# EAGLE design shield_confortimetro_bia_v2 (EAGLE 7.7.0)
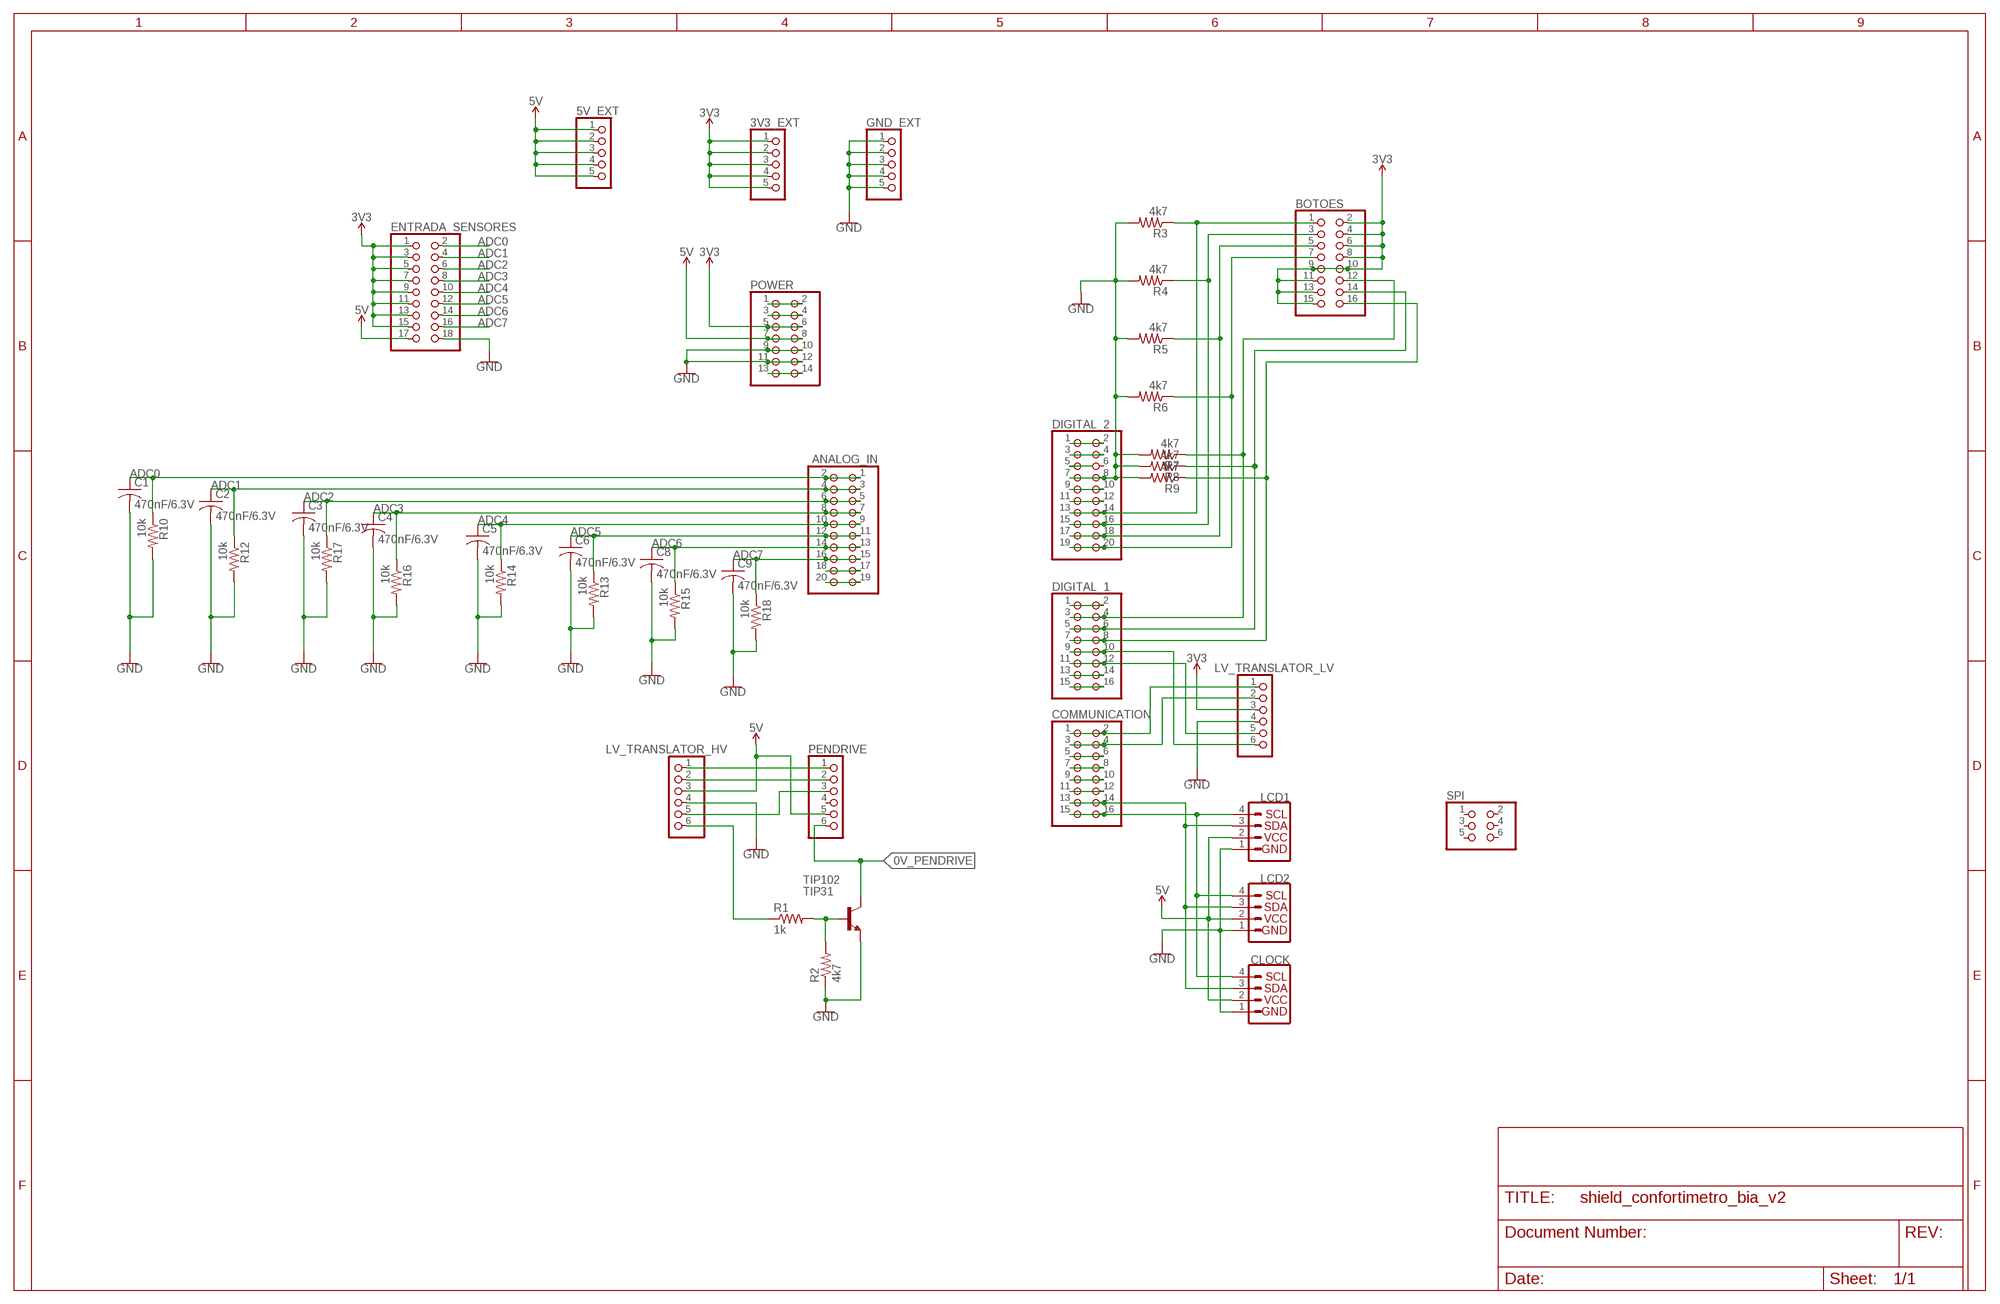
[diagram p0: schematic, sheet 1]

## Parts
3V3_EXT  PINHD-1X5  [1X05]
5V_EXT  PINHD-1X5  [1X05]
ANALOG_IN  PINHD-2X10  [2X10]
BOTOES  PINHD-2X8  [2X08]
C1  470nF/6.3V  C-US050-030X075  [C050-030X075]
C2  470nF/6.3V  C-US050-030X075  [C050-030X075]
C3  470nF/6.3V  C-US050-030X075  [C050-030X075]
C4  470nF/6.3V  C-US050-030X075  [C050-030X075]
C5  470nF/6.3V  C-US050-030X075  [C050-030X075]
C6  470nF/6.3V  C-US050-030X075  [C050-030X075]
C8  470nF/6.3V  C-US050-030X075  [C050-030X075]
C9  470nF/6.3V  C-US050-030X075  [C050-030X075]
CLOCK  I2C_STANDARD  [1X04]
COMMUNICATION  PINHD-2X8  [2X08]
DIGITAL_1  PINHD-2X8  [2X08]
DIGITAL_2  PINHD-2X10  [2X10]
ENTRADA_SENSORES  PINHD-2X9  [2X09]
GND_EXT  PINHD-1X5  [1X05]
LCD1  I2C_STANDARD  [1X04]
LCD2  I2C_STANDARD  [1X04]
LV_TRANSLATOR_HV  PINHD-1X6  [1X06]
LV_TRANSLATOR_LV  PINHD-1X6  [1X06]
PENDRIVE  PINHD-1X6  [1X06]
POWER  PINHD-2X7  [2X07]
R1  1k  R-US_0309/12  [0309/12]
R2  4k7  R-US_0309/12  [0309/12]
R3  4k7  R-US_0309/12  [0309/12]
R4  4k7  R-US_0309/12  [0309/12]
R5  4k7  R-US_0309/12  [0309/12]
R6  4k7  R-US_0309/12  [0309/12]
R7  4k7  R-US_0309/12  [0309/12]
R8  4k7  R-US_0309/12  [0309/12]
R9  4k7  R-US_0309/12  [0309/12]
R10  10k  R-US_0309/12  [0309/12]
R12  10k  R-US_0309/12  [0309/12]
R13  10k  R-US_0309/12  [0309/12]
R14  10k  R-US_0309/12  [0309/12]
R15  10k  R-US_0309/12  [0309/12]
R16  10k  R-US_0309/12  [0309/12]
R17  10k  R-US_0309/12  [0309/12]
R18  10k  R-US_0309/12  [0309/12]
SPI  PINHD-2X3  [2X03]
TIP102  TIP31  [TO220]

## Nets
0V_PENDRIVE: PENDRIVE.6 TIP102.2(C)
ADC0: ANALOG_IN.1 ANALOG_IN.2 C1.1 ENTRADA_SENSORES.2 R10.1
ADC1: ANALOG_IN.3 ANALOG_IN.4 C2.1 ENTRADA_SENSORES.4 R12.1
ADC2: ANALOG_IN.5 ANALOG_IN.6 C3.1 ENTRADA_SENSORES.6 R17.1
ADC3: ANALOG_IN.7 ANALOG_IN.8 C4.1 ENTRADA_SENSORES.8 R16.1
ADC4: ANALOG_IN.9 ANALOG_IN.10 C5.1 ENTRADA_SENSORES.10 R14.1
ADC5: ANALOG_IN.11 ANALOG_IN.12 C6.1 ENTRADA_SENSORES.12 R13.1
ADC6: ANALOG_IN.13 ANALOG_IN.14 C8.1 ENTRADA_SENSORES.14 R15.1
ADC7: ANALOG_IN.15 ANALOG_IN.16 C9.1 ENTRADA_SENSORES.16 R18.1
GND: C1.2 C2.2 C3.2 C4.2 C5.2 C6.2 C8.2 C9.2 CLOCK.1 DIGITAL_2.7 DIGITAL_2.8 ENTRADA_SENSORES.18 GND_EXT.1 GND_EXT.2 GND_EXT.3 GND_EXT.4 GND_EXT.5 LCD1.1 LCD2.1 LV_TRANSLATOR_HV.4 LV_TRANSLATOR_LV.4 POWER.9 POWER.10 POWER.11 POWER.12 R2.1 R3.2 R4.2 R5.2 R6.2 R7.2 R8.2 R9.2 R10.2 R12.2 R13.2 R14.2 R15.2 R16.2 R17.2 R18.2 TIP102.3(E)
N$1: CLOCK.3 COMMUNICATION.13 COMMUNICATION.14 LCD1.3 LCD2.3
N$2: CLOCK.4 COMMUNICATION.15 COMMUNICATION.16 LCD1.4 LCD2.4
N$3: COMMUNICATION.1 COMMUNICATION.2 LV_TRANSLATOR_LV.1
N$4: COMMUNICATION.3 COMMUNICATION.4 LV_TRANSLATOR_LV.2
N$5: DIGITAL_1.9 DIGITAL_1.10 LV_TRANSLATOR_LV.6
N$6: DIGITAL_1.11 DIGITAL_1.12 LV_TRANSLATOR_LV.5
N$7: LV_TRANSLATOR_HV.1 PENDRIVE.1
N$8: LV_TRANSLATOR_HV.2 PENDRIVE.2
N$9: LV_TRANSLATOR_HV.5 PENDRIVE.3
N$10: R1.2 R2.2 TIP102.1(B)
N$11: LV_TRANSLATOR_HV.6 R1.1
N$12: BOTOES.12 DIGITAL_1.3 DIGITAL_1.4 R7.1
N$13: BOTOES.14 DIGITAL_1.5 DIGITAL_1.6 R8.1
N$14: BOTOES.16 DIGITAL_1.7 DIGITAL_1.8 R9.1
N$15: BOTOES.7 DIGITAL_2.19 DIGITAL_2.20 R6.1
N$16: BOTOES.5 DIGITAL_2.17 DIGITAL_2.18 R5.1
N$17: BOTOES.3 DIGITAL_2.15 DIGITAL_2.16 R4.1
N$18: BOTOES.1 DIGITAL_2.13 DIGITAL_2.14 R3.1
N$19: POWER.1 POWER.2
N$20: POWER.3 POWER.4
N$21: POWER.13 POWER.14
N$25: DIGITAL_2.1 DIGITAL_2.2
N$26: DIGITAL_2.3 DIGITAL_2.4
N$27: DIGITAL_2.5
N$29: DIGITAL_2.9 DIGITAL_2.10
N$30: DIGITAL_2.11 DIGITAL_2.12
N$31: DIGITAL_1.1 DIGITAL_1.2
N$32: DIGITAL_1.13 DIGITAL_1.14
N$33: DIGITAL_1.15 DIGITAL_1.16
N$34: COMMUNICATION.5 COMMUNICATION.6
N$35: COMMUNICATION.7 COMMUNICATION.8
N$36: COMMUNICATION.9 COMMUNICATION.10
N$37: COMMUNICATION.11 COMMUNICATION.12
N$38: ANALOG_IN.17 ANALOG_IN.18
N$39: ANALOG_IN.19 ANALOG_IN.20
VCC_3V3: 3V3_EXT.1 3V3_EXT.2 3V3_EXT.3 3V3_EXT.4 3V3_EXT.5 BOTOES.2 BOTOES.4 BOTOES.6 BOTOES.8 BOTOES.9 BOTOES.10 BOTOES.11 BOTOES.13 BOTOES.15 ENTRADA_SENSORES.1 ENTRADA_SENSORES.3 ENTRADA_SENSORES.5 ENTRADA_SENSORES.7 ENTRADA_SENSORES.9 ENTRADA_SENSORES.11 ENTRADA_SENSORES.13 ENTRADA_SENSORES.15 LV_TRANSLATOR_LV.3 POWER.5 POWER.6 ; supply symbol labelled 3V3
VCC_5V: 5V_EXT.1 5V_EXT.2 5V_EXT.3 5V_EXT.4 5V_EXT.5 CLOCK.2 ENTRADA_SENSORES.17 LCD1.2 LCD2.2 LV_TRANSLATOR_HV.3 PENDRIVE.5 POWER.7 POWER.8 ; supply symbol labelled 5V
Unconnected: DIGITAL_2.6 PENDRIVE.4 SPI.1 SPI.2 SPI.3 SPI.4 SPI.5 SPI.6

## Library data of the parts
3V3_EXT 5V_EXT GND_EXT = pinhead:PINHD-1X5: PIN HEADER
ANALOG_IN = SparkFun-Retired:PINHD-2X10: PIN HEADER
BOTOES COMMUNICATION DIGITAL_1 = pinhead:PINHD-2X8: PIN HEADER
C1-C6 C8 C9 = adafruit:C-US: CAPACITOR, American symbol
CLOCK LCD1 LCD2 = SparkFun-Connectors:I2C_STANDARD: SparkFun I2C Standard Pinout Header SparkFun has standardized on a pinout for all I2C based sensor breakouts. This pinout allows I2C boards to be plugged directly into the headers on Arduino Uno compatible boards, and to be daisy chained easily. Example SparkFun Products: SparkFun Atmospheric Sensor Breakout - BME280 <https://www.sparkfun.com/products/13676> SparkFun Altitude/Pressure Sensor Breakout - MPL3115A2 <https://www.sparkfun.com/products/11084> SparkFun TOF Range Finder Sensor - VL6180 <https://www.sparkfun.com/products/12785>
DIGITAL_2 = pinhead:PINHD-2X10: PIN HEADER
ENTRADA_SENSORES = pinhead:PINHD-2X9: PIN HEADER
LV_TRANSLATOR_HV LV_TRANSLATOR_LV PENDRIVE = adafruit:PINHD-1X6: PIN HEADER
POWER = pinhead:PINHD-2X7: PIN HEADER
R1-R10 R12-R18 = adafruit:R-US_: RESISTOR, American symbol
SPI = pinhead:PINHD-2X3: PIN HEADER
TIP102 = transistor:TIP31: NPN Transistor Medium Power Linear Switching Applications Source: http://onsemi.com

## Board
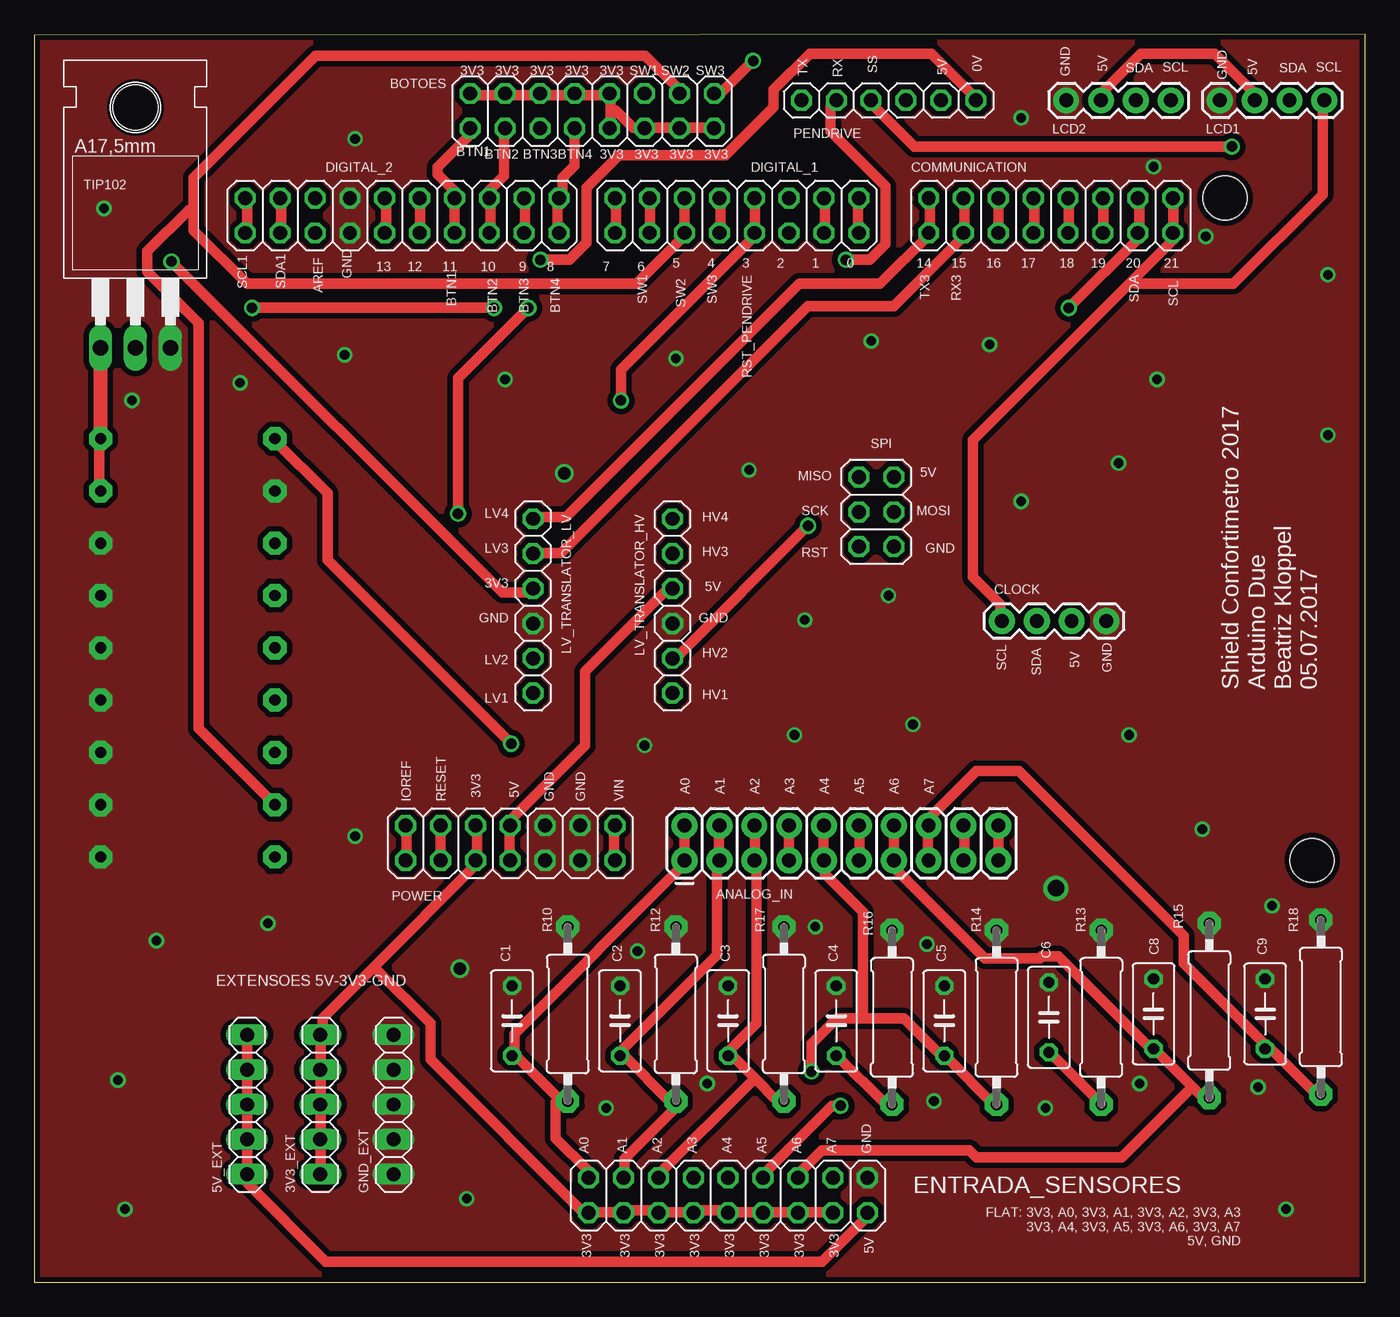
[diagram p1: board, top side]
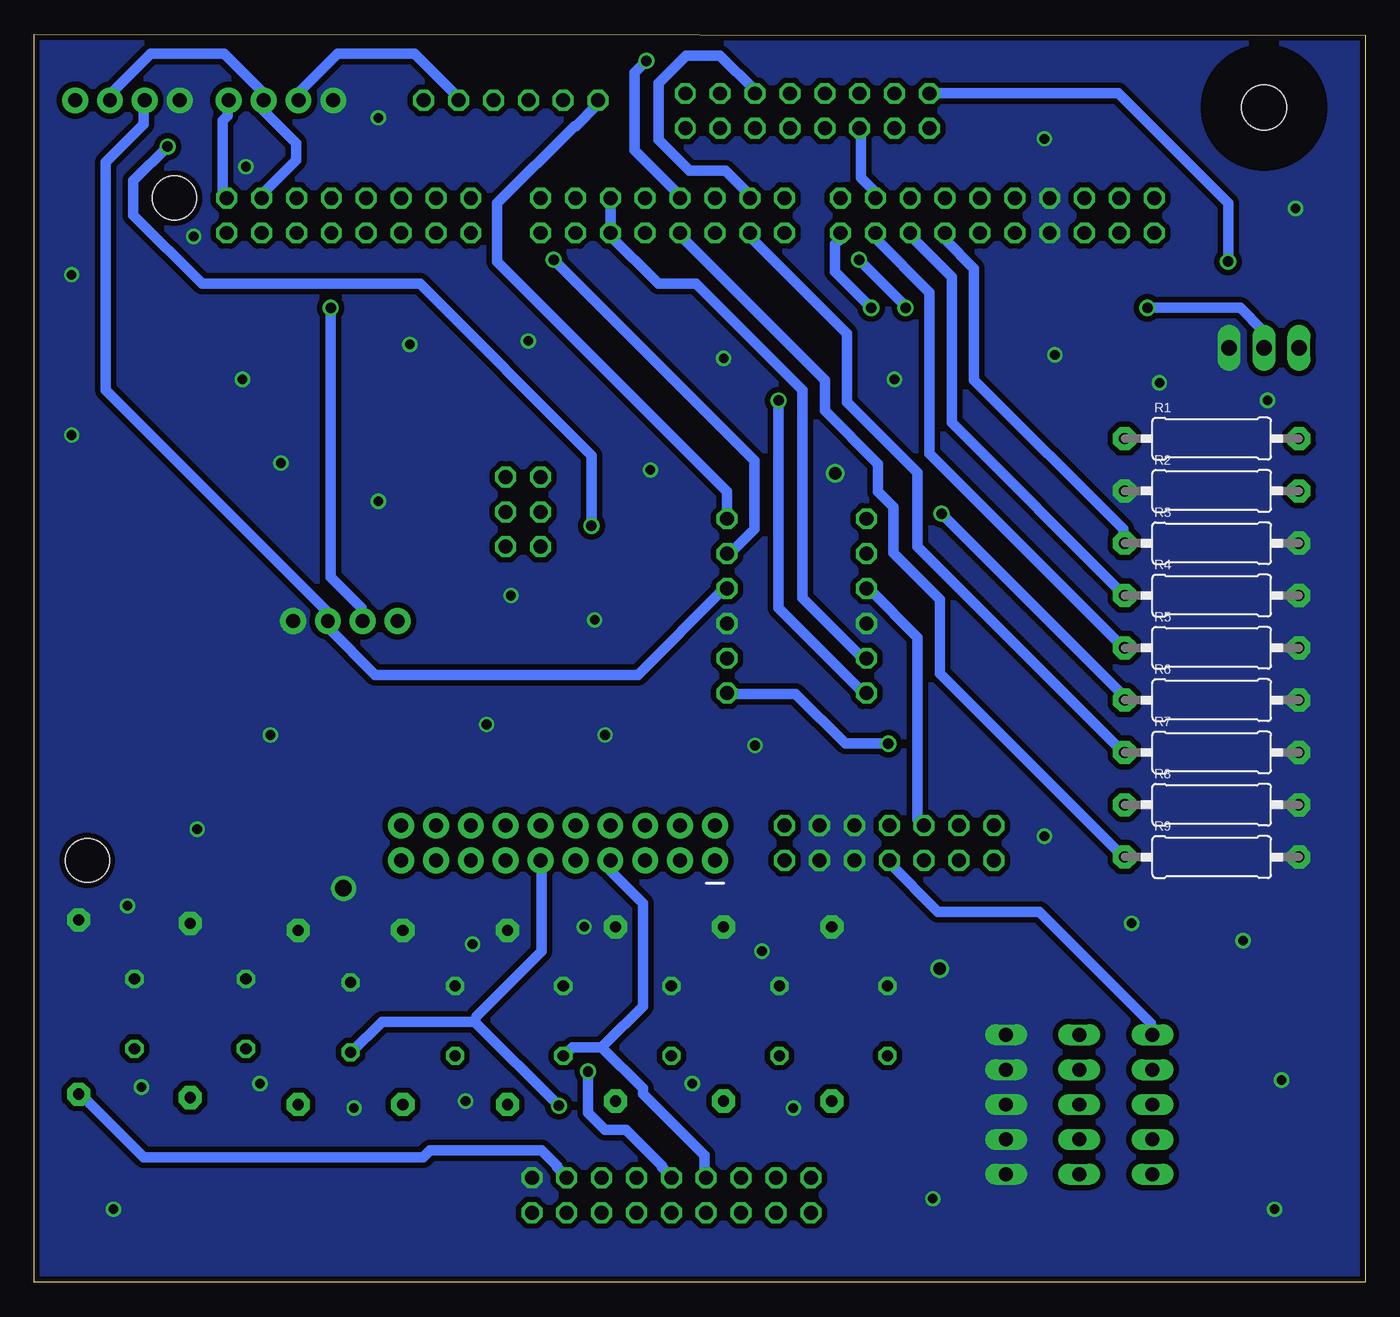
[diagram p2: board, bottom side, seen from below]

Size 96.95 x 90.92 mm. Coordinates in mm from the lower left corner, seen from the top.
Outline: 0,0 96.95,0 96.95,90.92 0,90.86 0,0
Copper layers (1*16): Top 0.035mm / dielectric 1.5mm / Bottom 0.035mm
Design rules "default *": minimum track width 30mil, minimum drill 30mil, track to track 16mil, track to pad 16mil, pad to pad 16mil, via to via 16mil, smd to smd 8mil, copper to edge 16mil, drill to drill 10mil, minimum pad ring 10mil, minimum via ring 8mil, stop-mask expansion 4mil, vias tented up to drill 0mil, thermal gap 10mil
Holes 3.2 mm at 93.09,30.73 86.74,78.99

### Footprints (pad centres in the part's own frame; a part is rotated, then mirrored left to right if it is on the bottom)
1X05 = drill 1.016 long: 1 -5.08,0; 2 -2.54,0; 3 0,0; 4 2.54,0; 5 5.08,0
2X10 = drill 1.016 pad 1.88: 1 0,0; 2 0,2.54; 3 2.54,0; 4 2.54,2.54; 5 5.08,0; 6 5.08,2.54; 7 7.62,0; 8 7.62,2.54; 9 10.16,0; 10 10.16,2.54; 11 12.7,0; 12 12.7,2.54; 13 15.24,0; 14 15.24,2.54; 15 17.78,0; 16 17.78,2.54; 17 20.32,0; 18 20.32,2.54; 19 22.86,0; 20 22.86,2.54
2X08 = drill 1.016 octagon: 1 -8.89,-1.27; 2 -8.89,1.27; 3 -6.35,-1.27; 4 -6.35,1.27; 5 -3.81,-1.27; 6 -3.81,1.27; 7 -1.27,-1.27; 8 -1.27,1.27; 9 1.27,-1.27; 10 1.27,1.27; 11 3.81,-1.27; 12 3.81,1.27; 13 6.35,-1.27; 14 6.35,1.27; 15 8.89,-1.27; 16 8.89,1.27
C050-030X075 = drill 0.813 octagon: 1 -2.54,0; 2 2.54,0
1X04 = drill 1.016 pad 1.88: 1 0,0; 2 2.54,0; 3 5.08,0; 4 7.62,0
2X10' = drill 1.016 octagon: 1 -11.43,-1.27; 2 -11.43,1.27; 3 -8.89,-1.27; 4 -8.89,1.27; 5 -6.35,-1.27; 6 -6.35,1.27; 7 -3.81,-1.27; 8 -3.81,1.27; 9 -1.27,-1.27; 10 -1.27,1.27; 11 1.27,-1.27; 12 1.27,1.27; 13 3.81,-1.27; 14 3.81,1.27; 15 6.35,-1.27; 16 6.35,1.27; 17 8.89,-1.27; 18 8.89,1.27; 19 11.43,-1.27; 20 11.43,1.27
2X09 = drill 1.016 octagon: 1 -10.16,-1.27; 2 -10.16,1.27; 3 -7.62,-1.27; 4 -7.62,1.27; 5 -5.08,-1.27; 6 -5.08,1.27; 7 -2.54,-1.27; 8 -2.54,1.27; 9 0,-1.27; 10 0,1.27; 11 2.54,-1.27; 12 2.54,1.27; 13 5.08,-1.27; 14 5.08,1.27; 15 7.62,-1.27; 16 7.62,1.27; 17 10.16,-1.27; 18 10.16,1.27
1X06 = drill 1.016 octagon: 1 -6.35,0; 2 -3.81,0; 3 -1.27,0; 4 1.27,0; 5 3.81,0; 6 6.35,0
2X07 = drill 1.016 octagon: 1 -7.62,-1.27; 2 -7.62,1.27; 3 -5.08,-1.27; 4 -5.08,1.27; 5 -2.54,-1.27; 6 -2.54,1.27; 7 0,-1.27; 8 0,1.27; 9 2.54,-1.27; 10 2.54,1.27; 11 5.08,-1.27; 12 5.08,1.27; 13 7.62,-1.27; 14 7.62,1.27
0309/12 = drill 0.813 pad 1.676 octagon: 1 -6.35,0; 2 6.35,0
2X03 = drill 1.016 octagon: 1 -2.54,-1.27; 2 -2.54,1.27; 3 0,-1.27; 4 0,1.27; 5 2.54,-1.27; 6 2.54,1.27
TO220 = drill 1.118 long: 1 -2.54,-6.35; 2 0,-6.35; 3 2.54,-6.35 | hole 3.302: 0,11.176

### Placement (x,y rotation side)
3V3_EXT  20.83,12.95 90 top
5V_EXT  15.49,12.95 90 top
ANALOG_IN  47.37,30.73 0 top
BOTOES  40.64,85.34 0 top
C1  34.8,19.05 90 top
C2  42.67,19.05 90 top
C3  50.55,19.05 90 top
C4  58.42,19.05 90 top
C5  66.29,19.05 90 top
C6  73.91,19.3 90 top
C8  81.53,19.56 90 top
C9  89.66,19.56 90 top
CLOCK  78.11,48.18 180 top
COMMUNICATION  74.04,77.72 0 top
DIGITAL_1  51.18,77.72 0 top
DIGITAL_2  [2X10']  26.8,77.72 0 top
ENTRADA_SENSORES  50.55,6.35 0 top
GND_EXT  26.16,12.95 90 top
LCD1  86.36,86.11 0 top
LCD2  75.17,86.11 0 top
LV_TRANSLATOR_HV  46.48,49.28 270 top
LV_TRANSLATOR_LV  36.32,49.28 270 top
PENDRIVE  62.23,86.11 0 top
POWER  34.67,32 0 top
R1  11.18,61.47 0 bottom
R2  11.18,57.66 0 bottom
R3  11.18,53.85 0 bottom
R4  11.18,50.04 0 bottom
R5  11.18,46.23 0 bottom
R6  11.18,42.42 0 bottom
R7  11.18,38.61 0 bottom
R8  11.18,34.8 0 bottom
R9  11.18,30.99 0 bottom
R10  38.86,19.56 90 top
R12  46.74,19.56 90 top
R13  77.72,19.3 90 top
R14  70.1,19.3 90 top
R15  85.6,19.81 90 top
R16  62.48,19.3 90 top
R17  54.61,19.56 90 top
R18  93.73,20.07 90 top
SPI  61.34,56.13 90 top
TIP102  7.37,74.42 0 top

### Tracks (layer width: path | path; a pad name or v marks a point on that pad's centre or on a via)
0V_PENDRIVE  (via drill 0.76)
  Top 0.762: v36.86,74.49 38.99,74.49 40.24,75.74 40.24,79.74 42.61,82.12 50.36,82.12 53.86,85.62 53.86,86.87 56.49,89.49 65.36,89.49 68.49,86.37 68.49,86.12 PENDRIVE.6 | v15.86,70.99 v33.49,70.99
  Bottom 0.762: v36.86,74.49 33.49,71.12 v33.49,70.99 | v15.86,70.99 9.11,70.99 7.49,69.37 7.49,68.12 TIP102.2
ADC0
  Top 0.762: ANALOG_IN.2 47.36,33.24 ANALOG_IN.1 47.24,30.37 34.99,18.12 34.99,16.87 C1.1 34.86,16.49 35.11,16.49 38.24,13.37 | 38.24,13.37 38.36,13.24 38.74,13.24 R10.1 | ENTRADA_SENSORES.2 40.36,7.74 40.36,8.12 37.99,10.49 37.99,13.12 38.24,13.37
ADC1
  Top 0.762: ANALOG_IN.4 49.86,33.24 49.86,30.74 ANALOG_IN.3 49.74,30.37 49.74,23.87 42.74,16.87 C2.1 42.74,16.49 42.99,16.49 46.24,13.24 46.61,13.24 R12.1 46.86,12.87 42.99,8.99 42.99,7.74 ENTRADA_SENSORES.4
ADC2
  Top 0.762: ANALOG_IN.6 52.49,33.24 52.49,30.74 ANALOG_IN.5 52.61,30.37 52.61,18.87 50.61,16.87 C3.1 50.61,16.49 50.86,16.49 52.49,14.87 | 52.49,14.87 54.11,13.24 54.49,13.24 R17.1 | ENTRADA_SENSORES.6 45.49,7.74 45.49,7.87 52.24,14.62 52.49,14.87
ADC3
  Top 0.762: ANALOG_IN.7 54.99,33.24 ANALOG_IN.8 | C4.1 58.49,16.49 61.99,12.99 62.36,12.99 R16.1
  Bottom 0.762: 55.61,17.12 52.61,14.12 52.61,13.74 48.11,9.24 48.11,7.74 ENTRADA_SENSORES.8 | 55.61,17.12 57.74,17.12 58.36,16.49 C4.1 | ANALOG_IN.7 54.99,30.62 54.99,29.99 52.61,27.62 52.61,20.12 55.36,17.37 55.61,17.12
ADC4  (via drill 0.76)
  Top 0.762: ANALOG_IN.10 57.49,33.24 57.49,30.74 ANALOG_IN.9 57.61,30.37 57.61,29.74 60.36,26.99 60.36,19.62 60.36,19.24 | R14.1 69.99,12.87 66.36,16.49 C5.1 65.99,16.62 63.36,19.24 60.36,19.24 | v56.61,15.37 56.61,17.37 58.49,19.24 60.36,19.24
  Bottom 0.762: v56.61,15.37 56.61,12.37 55.36,11.12 53.86,11.12 51.24,8.49 51.24,8.37 50.61,7.74 ENTRADA_SENSORES.10
ADC5  (via drill 0.76)
  Top 0.762: ANALOG_IN.11 60.11,30.74 60.11,33.24 ANALOG_IN.12 | C6.1 73.99,16.74 77.74,12.99 R13.1 | v58.74,12.87 58.11,12.87 53.11,7.87 53.11,7.74 ENTRADA_SENSORES.12
  Bottom 0.762: 64.86,18.99 v58.74,12.87 | 64.86,18.99 71.61,18.99 73.86,16.74 C6.1 | ANALOG_IN.11 59.99,30.62 59.99,24.12 64.74,19.37 64.86,18.99
ADC6
  Top 0.762: ANALOG_IN.14 62.61,33.24 ANALOG_IN.13 62.74,30.37 62.74,30.12 69.24,23.62 73.24,23.62 73.36,23.74 74.61,23.74 81.24,17.12 C8.1 81.61,16.99 84.36,14.24 | 84.36,14.24 85.11,13.49 85.49,13.49 R15.1 | ENTRADA_SENSORES.14 55.74,7.74 55.74,7.99 57.36,9.62 68.11,9.62 68.61,9.12 79.24,9.12 84.11,13.99 84.36,14.24
ADC7
  Top 0.762: ANALOG_IN.15 65.11,30.74 65.11,33.24 ANALOG_IN.16 65.24,33.62 65.24,33.87 68.61,37.24 71.74,37.24 83.74,25.24 83.74,23.24 89.61,17.37 C9.1 89.74,16.99 90.11,16.99 93.36,13.74 93.61,13.74 R18.1
  Bottom 0.762: ENTRADA_SENSORES.16 58.24,7.74 58.86,8.37 58.86,8.49 59.99,9.62 68.11,9.62 68.61,9.12 88.99,9.12 93.61,13.74 R18.1
GND  (via drill 0.7, 0.9, 1.2)
  other vias: 81.79,65.79 69.6,68.33 71.88,84.84 22.61,67.56 23.37,83.31 8.89,24.89 55.37,39.88 79.76,39.88 85.09,33.02 62.23,50.04 71.88,56.9 78.99,59.69 74.42,28.7 91.19,5.33 31.5,6.1 6.6,5.33 6.1,14.73 17.02,26.16 30.99,22.86 44.45,39.12 64.01,40.64 56.13,48.26 52.07,59.18 38.61,58.93 34.29,65.79 46.74,67.31 60.96,68.58 81.53,81.28 94.23,61.72 85.34,76.2 94.23,73.41 65.02,24.64 56.9,25.91 43.94,24.13 41.66,12.7 49.02,14.48 65.53,13.21 73.66,12.7 80.52,14.48 89.15,14.22 90.17,27.43 23.37,32.51 7.11,64.26 14.99,65.53 5.08,78.23
  pour Top (isolate 0.305, rank 2, no thermals): 0,90.93 0,0 97.03,0 97.03,4.06 97.28,4.06 97.28,90.93
  pour Bottom (isolate 0.406, rank 2, no thermals): 0,90.93 0,0 97.03,0 97.03,4.06 97.28,4.06 97.28,90.93
N$1  (via drill 0.76)
  Top 0.762: COMMUNICATION.14 80.49,78.99 80.49,76.49 COMMUNICATION.13 80.49,76.12 v75.36,70.99
  Bottom 0.762: v75.36,70.99 75.36,51.37 73.11,49.12 73.11,48.24 CLOCK.3 | COMMUNICATION.14 80.49,79.12 77.86,81.74 77.86,82.99 80.24,85.37 80.24,85.99 LCD2.3 79.99,86.37 83.11,89.49 88.49,89.49 91.36,86.62 91.36,86.12 LCD1.3
N$2
  Top 0.762: COMMUNICATION.16 82.99,78.99 82.99,76.49 COMMUNICATION.15 83.11,76.12 79.99,72.99 | 79.99,72.99 68.36,61.37 68.36,51.37 70.36,49.37 70.36,48.24 CLOCK.4 | LCD1.4 93.86,85.99 93.86,79.24 87.36,72.74 80.24,72.74 79.99,72.99
  Bottom 0.762: LCD2.4 82.86,85.99 82.86,84.99 83.24,84.62 83.24,79.37 82.99,79.12 COMMUNICATION.16
N$3
  Top 0.762: LV_TRANSLATOR_LV.1 36.36,55.74 38.74,55.74 55.74,72.74 61.61,72.74 65.24,76.37 COMMUNICATION.1 65.24,76.74 65.24,78.99 COMMUNICATION.2
N$4
  Top 0.762: LV_TRANSLATOR_LV.2 36.36,53.12 38.36,53.12 56.36,71.12 62.61,71.12 67.61,76.12 67.61,76.37 COMMUNICATION.3 67.74,76.74 67.74,78.99 COMMUNICATION.4
N$5  (via drill 0.76)
  Top 0.762: v42.74,64.24 42.74,66.49 52.36,76.12 52.36,76.37 DIGITAL_1.9 52.49,76.74 52.49,78.99 DIGITAL_1.10
  Bottom 0.762: v42.74,64.24 42.74,49.12 36.61,42.99 36.36,42.99 LV_TRANSLATOR_LV.6
N$6
  Bottom 0.762: LV_TRANSLATOR_LV.5 36.36,45.49 36.61,45.49 40.99,49.87 40.99,64.99 48.74,72.74 51.49,72.74 55.11,76.37 DIGITAL_1.11 54.99,76.74 DIGITAL_1.12
N$7
  Bottom 0.762: LV_TRANSLATOR_HV.1 46.49,55.74 46.49,57.62 63.24,74.37 63.24,78.62 57.61,84.24 57.49,84.24 55.99,85.74 55.99,85.99 PENDRIVE.1
N$8  (via drill 0.76)
  Top 0.762: v59.11,74.49 60.86,74.49 61.99,75.62 61.99,79.87 57.99,83.87 57.99,85.62 58.36,85.99 PENDRIVE.2
  Bottom 0.762: v59.11,74.49 44.49,59.87 44.49,54.87 46.24,53.12 46.36,53.12 LV_TRANSLATOR_HV.2
N$9  (via drill 0.76)
  Top 0.762: v56.36,55.12 46.74,45.49 46.49,45.49 LV_TRANSLATOR_HV.5 | v87.24,82.74 64.11,82.74 60.86,85.99 PENDRIVE.3
  Bottom 0.762: v56.36,55.12 56.36,60.24 68.86,72.74 84.74,72.74 89.74,77.74 89.74,80.24 v87.24,82.74
N$10
  Top 0.762: R2.2 4.74,57.74 4.74,61.37 R1.2
  Top 1.016: R1.2 TIP102.1
N$11  (via drill 0.76)
  Top 0.762: v34.74,39.24 21.36,52.62 21.36,57.49 17.49,61.37 R1.1
  Bottom 0.762: v34.74,39.24 37.86,39.24 41.49,42.87 46.36,42.87 LV_TRANSLATOR_HV.6
N$12
  Top 0.762: DIGITAL_1.3 44.86,76.49 44.86,78.99 DIGITAL_1.4
  Bottom 0.762: BOTOES.12 44.49,86.62 44.49,86.87 46.99,89.37 49.49,89.37 51.49,87.37 51.49,83.24 49.24,80.99 46.61,80.99 44.74,79.12 DIGITAL_1.4 | R7.1 17.61,38.62 32.61,53.62 32.61,58.99 37.74,64.12 37.74,69.12 44.74,76.12 44.74,76.37 DIGITAL_1.3
N$13
  Top 0.762: DIGITAL_1.6 47.36,76.49 DIGITAL_1.5 47.24,76.12 43.86,72.74 15.49,72.74 11.61,76.62 11.61,78.12 | 11.61,78.12 11.61,80.49 20.49,89.37 44.49,89.37 46.99,86.87 BOTOES.14 | R8.1 17.49,34.87 11.99,40.37 11.99,69.87 8.24,73.62 8.24,75.12 11.24,78.12 11.61,78.12
N$14  (via drill 0.76)
  Top 0.762: DIGITAL_1.7 49.99,76.49 49.99,78.99 DIGITAL_1.8 | v52.36,88.99 49.99,86.62 49.61,86.62 BOTOES.16
  Bottom 0.762: v52.36,88.99 53.24,88.12 53.24,82.49 49.86,79.12 DIGITAL_1.8 | R9.1 17.61,30.99 30.99,44.37 30.99,49.74 34.36,53.12 34.36,56.49 35.49,57.62 35.49,59.62 39.36,63.49 39.36,65.74 49.99,76.37 DIGITAL_1.7
N$15  (via drill 0.76)
  Top 0.762: DIGITAL_2.19 38.11,76.49 38.11,78.99 DIGITAL_2.20 38.49,79.24 38.49,80.49 39.36,81.37 39.36,83.99 BOTOES.7 | v30.86,55.99 30.86,65.87 v35.99,70.99
  Bottom 0.762: v30.86,55.99 17.61,42.74 17.61,42.49 R6.1 | v35.99,70.99 38.61,73.62 38.61,75.62 38.24,75.99 38.24,76.37 DIGITAL_2.19
N$16
  Top 0.762: DIGITAL_2.17 35.74,76.49 35.74,78.99 DIGITAL_2.18
  Bottom 0.762: BOTOES.5 36.74,83.99 36.74,80.49 35.74,79.49 35.74,79.12 DIGITAL_2.18 | R5.1 17.61,46.24 31.74,60.37 31.74,72.12 35.61,75.99 35.61,76.37 DIGITAL_2.17
N$17
  Top 0.762: DIGITAL_2.15 33.24,76.49 33.24,78.99 DIGITAL_2.16 32.99,79.37 34.24,80.62 34.24,83.99 BOTOES.3
  Bottom 0.762: R4.1 17.61,50.12 30.11,62.62 30.11,73.24 33.24,76.37 DIGITAL_2.15
N$18
  Top 0.762: DIGITAL_2.13 30.61,76.49 DIGITAL_2.14 30.74,79.37 29.36,80.74 29.36,81.24 31.74,83.62 31.74,83.99 BOTOES.1
  Bottom 0.762: R3.1 17.61,53.87 17.61,54.87 28.49,65.74 28.49,73.87 30.61,75.99 30.61,76.37 DIGITAL_2.13
N$19
  Top 0.762: POWER.1 27.11,30.74 27.11,33.24 POWER.2
N$20
  Top 0.762: POWER.3 29.61,30.74 29.61,33.24 POWER.4
N$21
  Top 0.762: POWER.13 42.24,30.74 42.24,33.24 POWER.14
N$25
  Top 0.762: DIGITAL_2.1 15.49,76.49 15.49,78.99 DIGITAL_2.2
N$26
  Top 0.762: DIGITAL_2.3 17.99,76.49 17.99,78.99 DIGITAL_2.4
N$29
  Top 0.762: DIGITAL_2.9 25.61,76.49 25.61,78.99 DIGITAL_2.10
N$30
  Top 0.762: DIGITAL_2.11 28.11,76.49 28.11,78.99 DIGITAL_2.12
N$31
  Top 0.762: DIGITAL_1.1 42.36,76.49 42.36,78.99 DIGITAL_1.2
N$32
  Top 0.762: DIGITAL_1.13 57.61,76.49 57.61,78.99 DIGITAL_1.14
N$33
  Top 0.762: DIGITAL_1.15 59.99,76.49 59.99,78.99 DIGITAL_1.16
N$34
  Top 0.762: COMMUNICATION.5 70.24,76.49 COMMUNICATION.6
N$35
  Top 0.762: COMMUNICATION.7 72.86,76.49 72.86,78.99 COMMUNICATION.8
N$36
  Top 0.762: COMMUNICATION.9 75.36,76.49 75.36,78.99 COMMUNICATION.10
N$37
  Top 0.762: COMMUNICATION.11 77.86,76.49 77.86,78.99 COMMUNICATION.12
N$38
  Top 0.762: ANALOG_IN.17 67.74,30.74 67.74,33.24 ANALOG_IN.18
N$39
  Top 0.762: ANALOG_IN.19 70.24,33.24 ANALOG_IN.20
VCC_3V3  (via drill 0.76)
  Top 0.762: BOTOES.2 31.86,86.49 34.24,86.49 BOTOES.4 34.61,86.49 36.74,86.49 BOTOES.6 37.11,86.49 38.99,86.49 BOTOES.8 39.49,86.49 41.61,86.49 BOTOES.10 41.99,86.49 41.99,85.37 | BOTOES.15 49.49,84.12 47.11,84.12 BOTOES.13 46.61,84.12 44.74,84.12 BOTOES.11 44.36,84.12 43.61,84.12 42.36,85.37 41.99,85.37 | 41.99,85.37 41.99,84.12 BOTOES.9 | ENTRADA_SENSORES.15 58.11,5.12 55.99,5.12 ENTRADA_SENSORES.13 55.61,5.12 53.36,5.12 ENTRADA_SENSORES.11 52.99,5.12 50.61,5.12 ENTRADA_SENSORES.9 50.24,5.24 48.36,5.24 ENTRADA_SENSORES.7 47.99,5.12 45.49,5.12 ENTRADA_SENSORES.5 45.11,5.24 43.24,5.24 ENTRADA_SENSORES.3 42.86,5.12 40.49,5.12 ENTRADA_SENSORES.1 39.99,5.12 28.86,16.24 28.86,18.87 24.99,22.74 24.74,22.99 | 3V3_EXT.1 20.86,7.99 20.86,10.37 3V3_EXT.2 20.86,10.74 20.86,12.87 3V3_EXT.3 20.86,13.24 20.86,15.49 3V3_EXT.4 20.86,15.87 20.86,17.99 3V3_EXT.5 20.99,18.37 20.99,19.24 24.74,22.99 | POWER.6 32.24,33.24 32.24,30.74 POWER.5 32.11,30.37 24.74,22.99 | v9.99,74.37 34.11,50.24 35.86,50.24 36.24,50.62 LV_TRANSLATOR_LV.3
  Bottom 0.762: LV_TRANSLATOR_LV.3 36.24,50.49 36.11,50.49 32.61,46.99 32.61,33.74 32.24,33.37 POWER.6 | v9.99,74.37 9.99,78.62 17.99,86.62 BOTOES.2
VCC_5V
  Top 0.762: 5V_EXT.5 15.49,17.99 15.49,15.87 5V_EXT.4 15.49,13.24 5V_EXT.3 15.49,12.87 15.49,10.74 5V_EXT.2 15.49,10.37 15.49,7.99 5V_EXT.1 15.49,7.49 15.49,7.24 21.24,1.49 57.36,1.49 60.61,4.74 60.61,4.99 ENTRADA_SENSORES.17 | LCD1.2 88.86,86.12 88.86,86.62 85.99,89.49 80.61,89.49 77.74,86.62 77.74,86.12 LCD2.2 | POWER.7 34.61,30.74 34.61,33.24 POWER.8 34.61,33.62 40.11,39.12 40.11,44.49 46.11,50.49 46.36,50.49 LV_TRANSLATOR_HV.3
  Bottom 0.762: PENDRIVE.5 66.11,86.12 66.11,86.37 69.24,89.49 74.86,89.49 77.61,86.74 77.61,86.12 LCD2.2 | LV_TRANSLATOR_HV.3 46.49,50.49 46.74,50.49 52.99,44.24 72.11,44.24 75.49,47.62 75.49,48.12 CLOCK.2 75.49,48.49 75.49,48.74 91.74,64.99 91.74,81.62 88.99,84.37 88.99,85.99 LCD1.2 | 5V_EXT.5 15.61,18.12 15.61,18.87 23.74,26.99 31.11,26.99 34.74,30.62 POWER.7

### Text on the board
tNames: TX | RX | SS | 5V | 0V | 5V | SCL | 5V | SCL | 3V3 | 3V3 | 3V3 | 3V3 | 3V3 | SW1 | SW2 | SW3 | GND | SDA | SDA | GND | BTN1 | BTN2 | BTN3 | BTN4 | 3V3 | 3V3 | 3V3 | 3V3 | AREF | 5 | 4 | 3 | 2 | 1 | 0 | 14 | 15 | 16 | 17 | 18 | 19 | 20 | 21 | GND | 13 | 12 | 11 | 10 | BTN2 | 9 | BTN3 | 8 | BTN4 | 7 | 6 | SW1 | SW2 | SW3 | RST_PENDRIVE | TX3 | RX3 | SDA | SCL1 | SDA1 | BTN1 | SCL | MISO | 5V | LV4 | HV4 | SCK | MOSI | LV3 | HV3 | GND | RST | 3V3 | 5V | GND | GND | HV2 | SCL | SDA | 5V | LV2 | GND | LV1 | HV1 | Shield Confortimetro 2017 / Arduino Due / Beatriz Kloppel / 05.07.2017 | IOREF | RESET | 3V3 | 5V | GND | GND | VIN | A0 | A1 | A2 | A3 | A4 | A5 | A6 | A7 | EXTENSOES 5V-3V3-GND | A0 | A1 | A2 | A3 | A4 | A5 | A6 | A7 | GND | FLAT: 3V3, A0, 3V3, A1, 3V3, A2, 3V3, A3 / 3V3, A4, 3V3, A5, 3V3, A6, 3V3, A7 / 5V, GND | 3V3 | 3V3 | 3V3 | 3V3 | 3V3 | 3V3 | 3V3 | 3V3 | 5V